# EAGLE design GolGrid-distances (EAGLE 5.11)
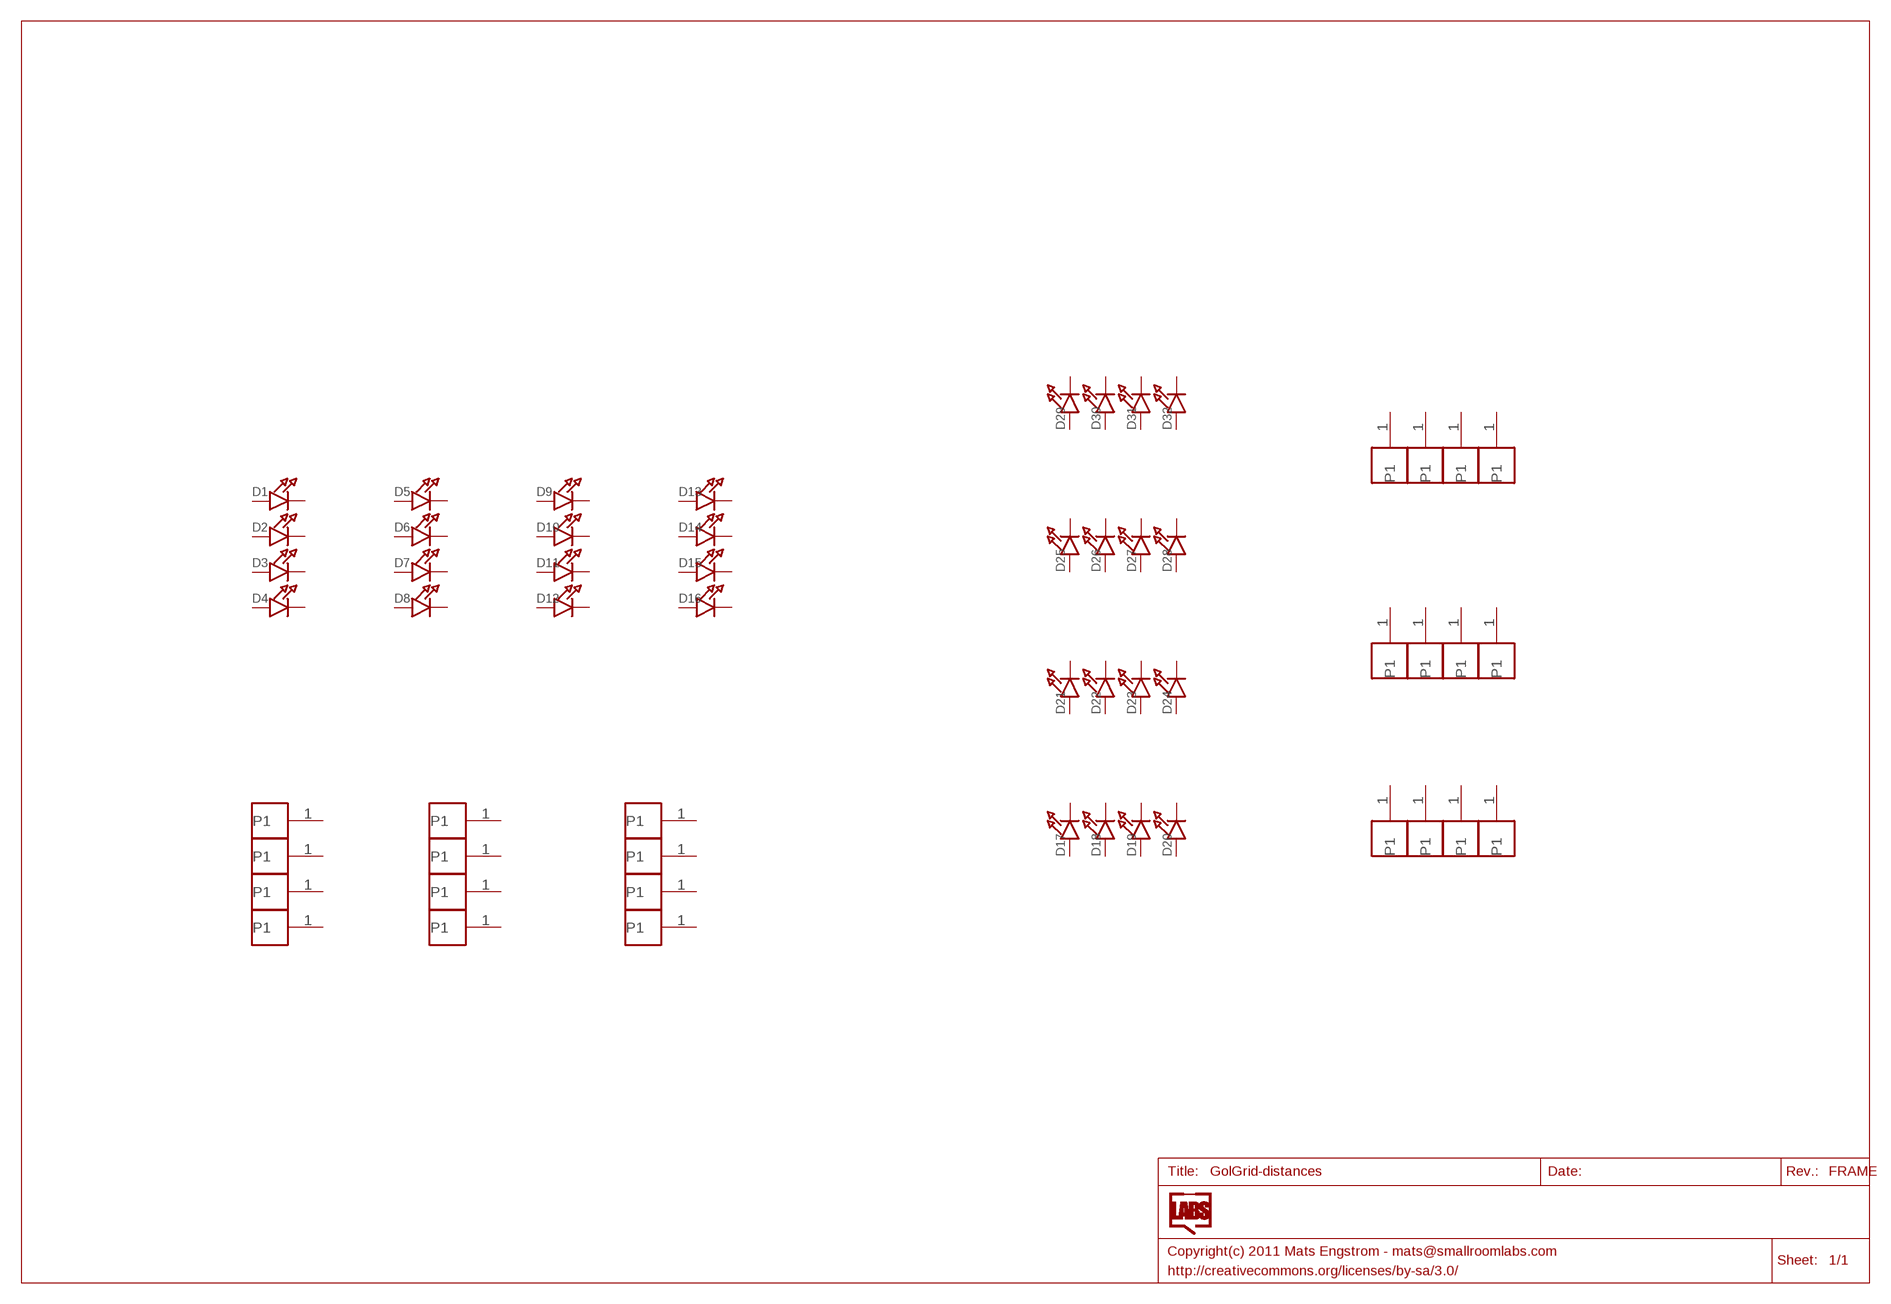
[diagram p0: schematic, sheet 1]

## Parts
D1  LEDSMD0805  [CHIPLED_0805]
D2  LEDSMD0805  [CHIPLED_0805]
D3  LEDSMD0805  [CHIPLED_0805]
D4  LEDSMD0805  [CHIPLED_0805]
D5  LEDSMD0805  [CHIPLED_0805]
D6  LEDSMD0805  [CHIPLED_0805]
D7  LEDSMD0805  [CHIPLED_0805]
D8  LEDSMD0805  [CHIPLED_0805]
D9  LEDSMD0805  [CHIPLED_0805]
D10  LEDSMD0805  [CHIPLED_0805]
D11  LEDSMD0805  [CHIPLED_0805]
D12  LEDSMD0805  [CHIPLED_0805]
D13  LEDSMD0805  [CHIPLED_0805]
D14  LEDSMD0805  [CHIPLED_0805]
D15  LEDSMD0805  [CHIPLED_0805]
D16  LEDSMD0805  [CHIPLED_0805]
D17  LEDSMD0805  [CHIPLED_0805]
D18  LEDSMD0805  [CHIPLED_0805]
D19  LEDSMD0805  [CHIPLED_0805]
D20  LEDSMD0805  [CHIPLED_0805]
D21  LEDSMD0805  [CHIPLED_0805]
D22  LEDSMD0805  [CHIPLED_0805]
D23  LEDSMD0805  [CHIPLED_0805]
D24  LEDSMD0805  [CHIPLED_0805]
D25  LEDSMD0805  [CHIPLED_0805]
D26  LEDSMD0805  [CHIPLED_0805]
D27  LEDSMD0805  [CHIPLED_0805]
D28  LEDSMD0805  [CHIPLED_0805]
D29  LEDSMD0805  [CHIPLED_0805]
D30  LEDSMD0805  [CHIPLED_0805]
D31  LEDSMD0805  [CHIPLED_0805]
D32  LEDSMD0805  [CHIPLED_0805]
P1  PAD06S1  [PAD06STOP1]
P2  PAD06S1  [PAD06STOP1]
P3  PAD06S1  [PAD06STOP1]
P4  PAD06S1  [PAD06STOP1]
P5  PAD06S1  [PAD06STOP1]
P6  PAD06S1  [PAD06STOP1]
P7  PAD06S1  [PAD06STOP1]
P8  PAD06S1  [PAD06STOP1]
P9  PAD06S1  [PAD06STOP1]
P10  PAD06S1  [PAD06STOP1]
P11  PAD06S1  [PAD06STOP1]
P12  PAD06S1  [PAD06STOP1]
P13  PAD06S1  [PAD06STOP1]
P14  PAD06S1  [PAD06STOP1]
P15  PAD06S1  [PAD06STOP1]
P16  PAD06S1  [PAD06STOP1]
P17  PAD06S1  [PAD06STOP1]
P18  PAD06S1  [PAD06STOP1]
P19  PAD06S1  [PAD06STOP1]
P20  PAD06S1  [PAD06STOP1]
P21  PAD06S1  [PAD06STOP1]
P22  PAD06S1  [PAD06STOP1]
P23  PAD06S1  [PAD06STOP1]
P24  PAD06S1  [PAD06STOP1]
Unconnected: D1.A D1.C D2.A D2.C D3.A D3.C D4.A D4.C D5.A D5.C D6.A D6.C D7.A D7.C D8.A D8.C D9.A D9.C D10.A D10.C D11.A D11.C D12.A D12.C D13.A D13.C D14.A D14.C D15.A D15.C D16.A D16.C D17.A D17.C D18.A D18.C D19.A D19.C D20.A D20.C D21.A D21.C D22.A D22.C D23.A D23.C D24.A D24.C D25.A D25.C D26.A D26.C D27.A D27.C D28.A D28.C D29.A D29.C D30.A D30.C D31.A D31.C D32.A D32.C P1.1 P2.1 P3.1 P4.1 P5.1 P6.1 P7.1 P8.1 P9.1 P10.1 P11.1 P12.1 P13.1 P14.1 P15.1 P16.1 P17.1 P18.1 P19.1 P20.1 P21.1 P22.1 P23.1 P24.1

## Library data of the parts
D1-D32 = SmallRoomLabs:LED
P1-P24 = SmallRoomLabs:PAD

## Board
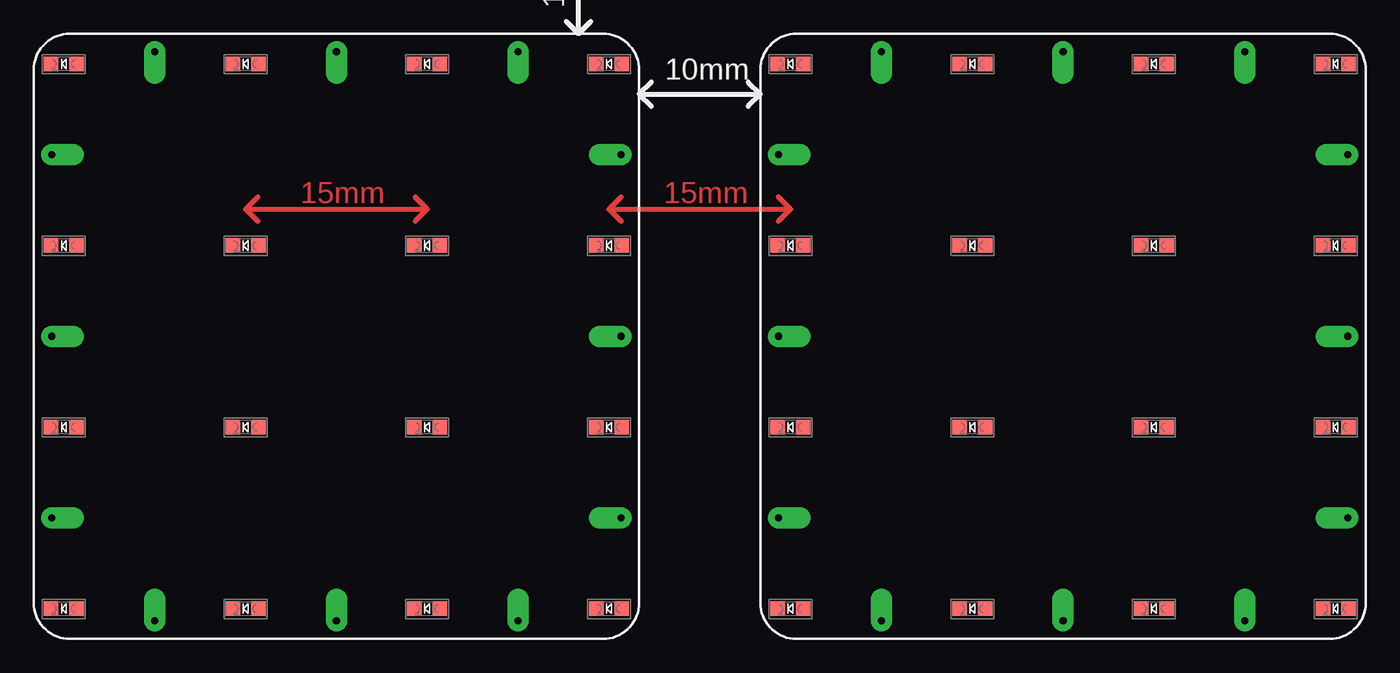
[diagram p1: board, top side]

No outline drawn. Coordinates in mm, seen from the top.
Copper layers (1*16): Top 0.035mm / dielectric 1.5mm / Bottom 0.035mm
Design rules "Fusion_eagle_rule_v1.1": minimum track width 6mil, minimum drill 12mil, track to track 6mil, track to pad 6mil, pad to pad 6mil, via to via 6mil, smd to smd 0mil, copper to edge 10mil, drill to drill 10mil, minimum pad ring 10mil, minimum via ring 6mil, stop-mask expansion 2mil, vias tented up to drill 100mil, thermal gap 10mil

### Footprints (pad centres in the part's own frame; a part is rotated, then mirrored left to right if it is on the bottom)
CHIPLED_0805 = smd 1.2 x 1.2: A 0,-1.05; C 0,1.05
PAD06STOP1 = drill 0.6 pad 1.778 offset: 1 0,0

### Placement (x,y rotation side)
D1  2.5,47.5 90 top
D2  17.5,47.5 90 top
D3  32.5,47.5 90 top
D4  47.5,47.5 90 top
D5  2.5,32.5 90 top
D6  17.5,32.5 90 top
D7  32.5,32.5 90 top
D8  47.5,32.5 90 top
D9  2.5,17.5 90 top
D10  17.5,17.5 90 top
D11  32.5,17.5 90 top
D12  47.5,17.5 90 top
D13  2.5,2.5 90 top
D14  17.5,2.5 90 top
D15  32.5,2.5 90 top
D16  47.5,2.5 90 top
D17  62.5,47.5 90 top
D18  77.5,32.5 90 top
D19  62.5,32.5 90 top
D20  77.5,2.5 90 top
D21  62.5,2.5 90 top
D22  77.5,47.5 90 top
D23  92.5,32.5 90 top
D24  62.5,17.5 90 top
D25  107.5,2.5 90 top
D26  92.5,2.5 90 top
D27  92.5,47.5 90 top
D28  107.5,32.5 90 top
D29  107.5,17.5 90 top
D30  92.5,17.5 90 top
D31  77.5,17.5 90 top
D32  107.5,47.5 90 top
P1  1.5,25 0 top
P2  25,1.5 90 top
P3  48.5,25 180 top
P4  25,48.5 270 top
P5  1.5,40 0 top
P6  48.5,40 180 top
P7  40,48.5 270 top
P8  40,1.5 90 top
P9  10,1.5 90 top
P10  1.5,10 0 top
P11  48.5,10 180 top
P12  10,48.5 270 top
P13  61.5,10 0 top
P14  61.5,25 0 top
P15  70,1.5 90 top
P16  61.5,40 0 top
P17  85,48.5 270 top
P18  70,48.5 270 top
P19  108.5,40 180 top
P20  85,1.5 90 top
P21  100,48.5 270 top
P22  108.5,10 180 top
P23  108.5,25 180 top
P24  100,1.5 90 top

### Tracks (layer width: path | path; a pad name or v marks a point on that pad's centre or on a via)
N$1
  Top 0.406: 48.5,36.5 47.5,35.5 48.5,34.5
N$2
  Top 0.406: 48,35.5 62.5,35.5 | 62.5,35.5 61.5,36.5 | 62.5,35.5 61.5,34.5
N$3
  Top 0.406: 18.5,36.5 17.5,35.5 18.5,34.5
N$4
  Top 0.406: 18,35.5 32.5,35.5 | 32.5,35.5 31.5,36.5 | 32.5,35.5 31.5,34.5

### Text on the board
Top: 15mm | 15mm
dxf: 13mm
_tsilk: 10mm | 10mm | 10mm